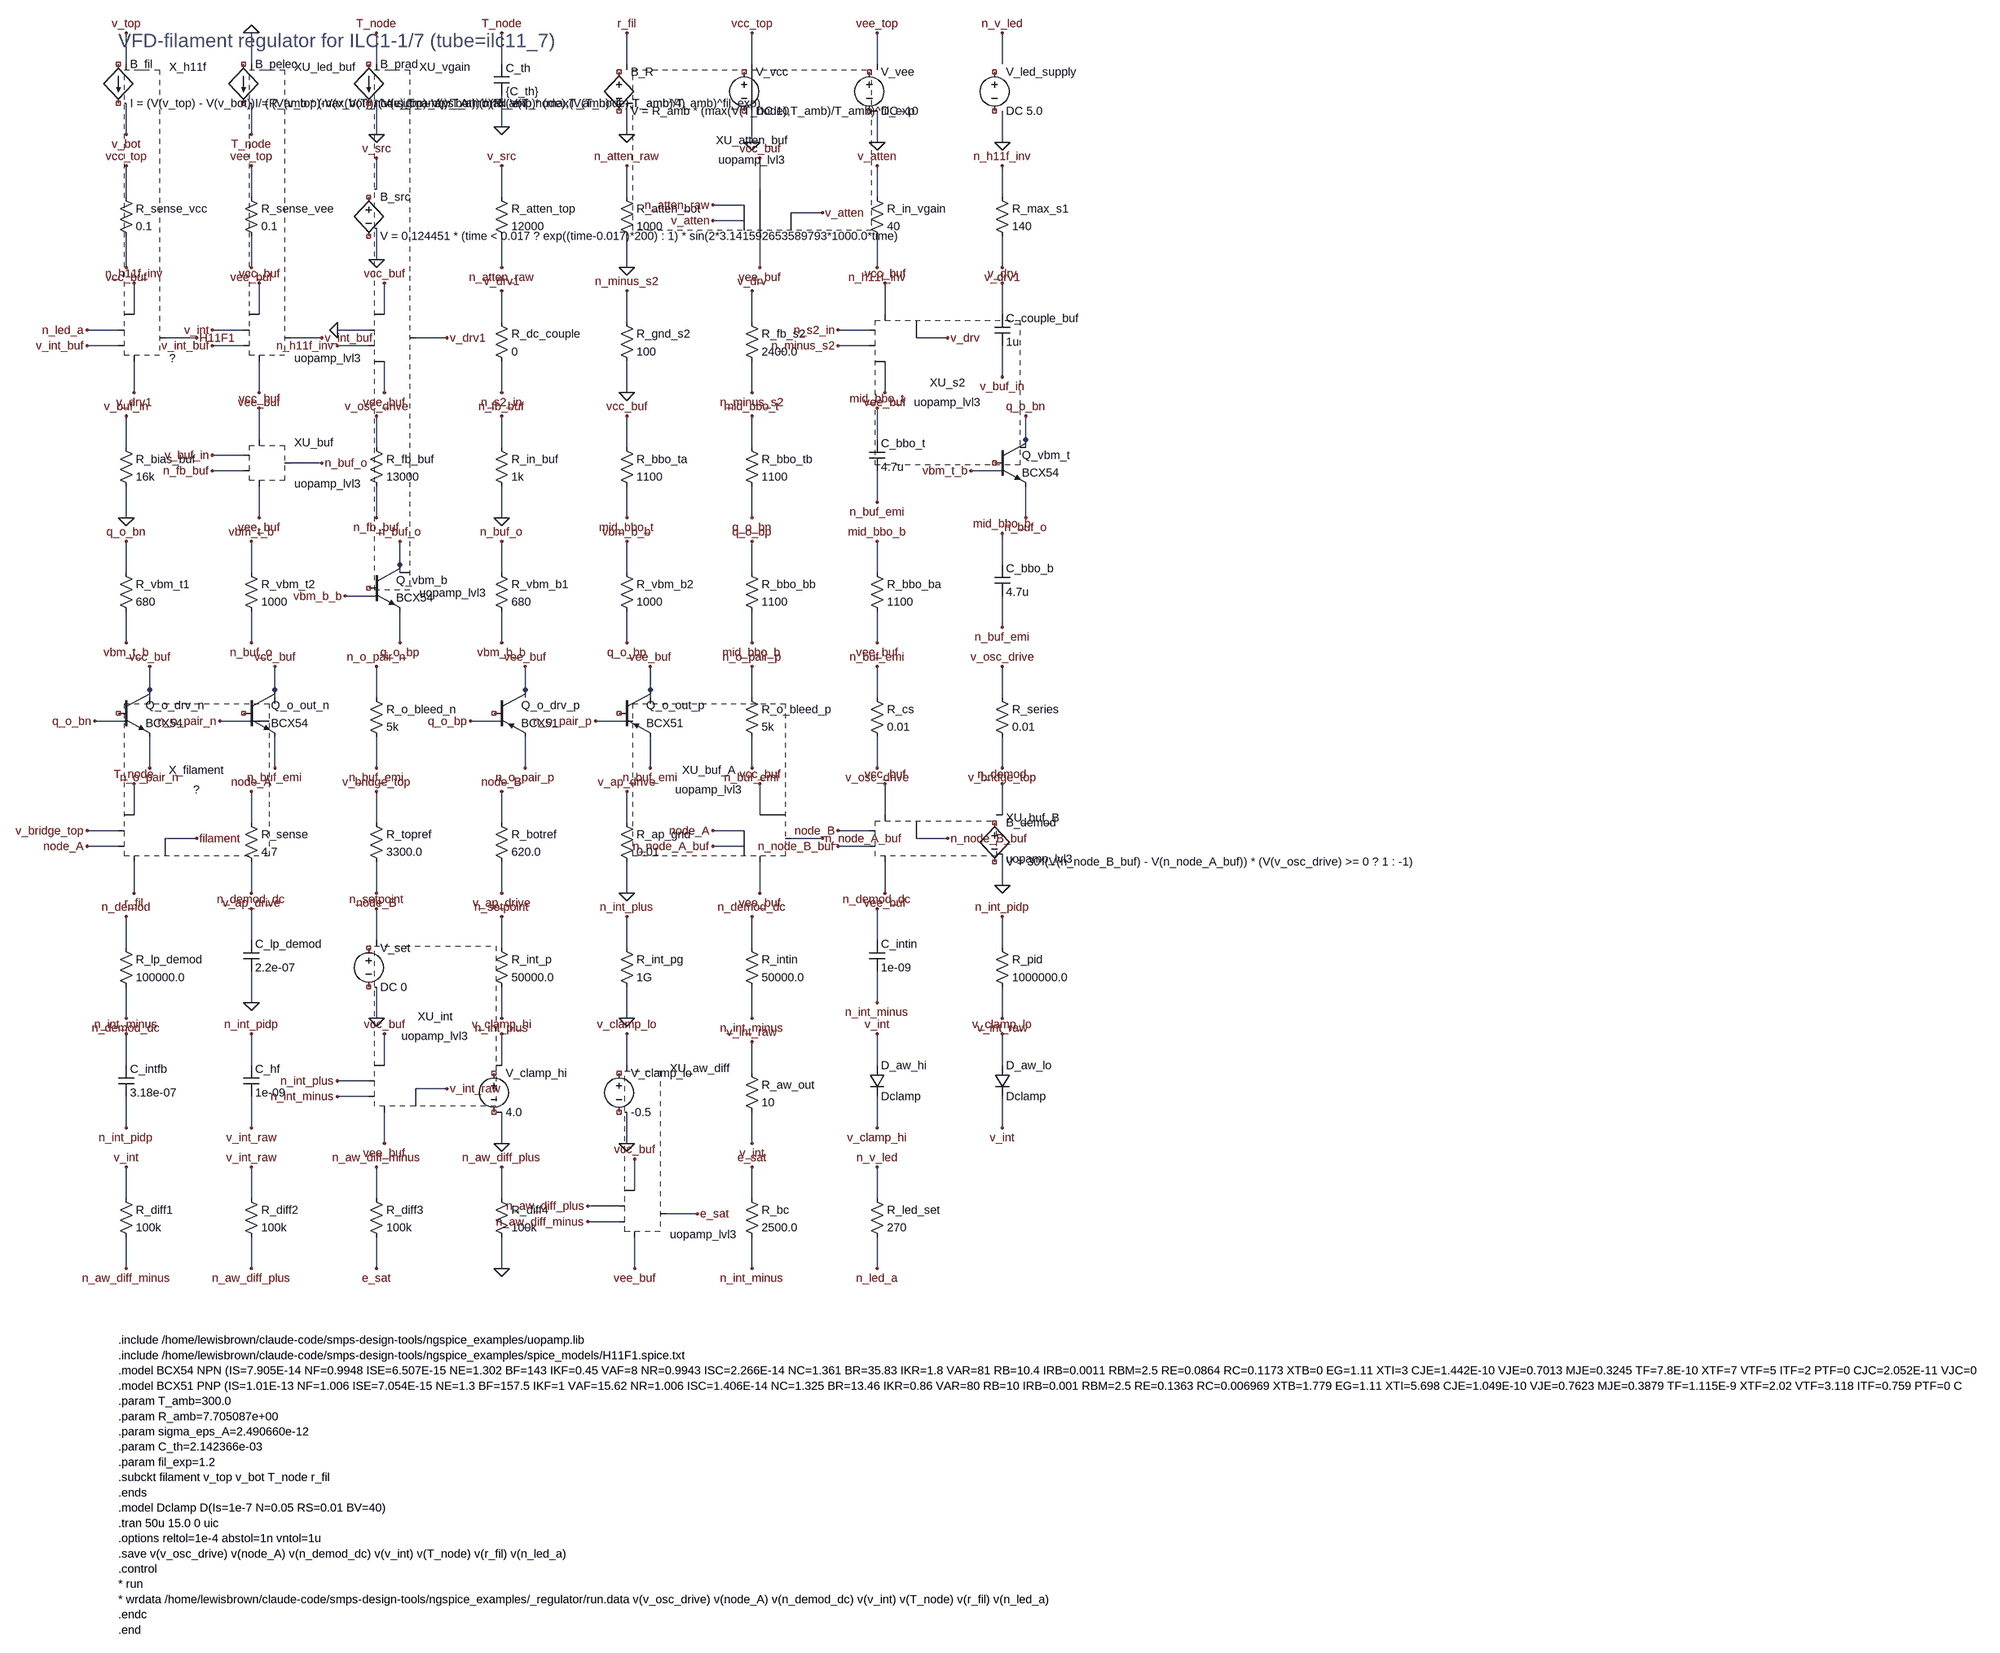
[diagram p0: schematic regulator_ilc11_7.asc]
regulator_ilc11_7.asc, the LTspice schematic file:
Version 4
SHEET 1 8000 8000
TEXT 64 16 Left 4 ;VFD-filament regulator for ILC1-1/7 (tube=ilc11_7)
SYMBOL bi 64 64 R0
SYMATTR InstName B_fil
SYMATTR Value I = (V(v_top) - V(v_bot)) / (R_amb * (max(V(T_node),T_amb)/T_amb)^fil_exp)
WIRE 80 64 80 0
FLAG 80 0 v_top
WIRE 80 144 80 208
FLAG 80 208 v_bot
SYMBOL bi 320 64 R0
SYMATTR InstName B_pelec
SYMATTR Value I = (V(v_top)-V(v_bot))*(V(v_top)-V(v_bot)) / (R_amb * (max(V(T_node),T_amb)/T_amb)^fil_exp)
WIRE 336 64 336 0
FLAG 336 0 0
WIRE 336 144 336 208
FLAG 336 208 T_node
SYMBOL bi 576 64 R0
SYMATTR InstName B_prad
SYMATTR Value I = sigma_eps_A * (max(V(T_node),T_amb)^4 - T_amb^4)
WIRE 592 64 592 0
FLAG 592 0 T_node
WIRE 592 144 592 208
FLAG 592 208 0
SYMBOL cap 832 64 R0
SYMATTR InstName C_th
SYMATTR Value {C_th}
WIRE 848 64 848 0
FLAG 848 0 T_node
WIRE 848 128 848 192
FLAG 848 192 0
SYMBOL bv 1088 64 R0
SYMATTR InstName B_R
SYMATTR Value V = R_amb * (max(V(T_node),T_amb)/T_amb)^fil_exp
WIRE 1104 64 1104 0
FLAG 1104 0 r_fil
WIRE 1104 144 1104 208
FLAG 1104 208 0
SYMBOL voltage 1344 64 R0
SYMATTR InstName V_vcc
SYMATTR Value DC 10
WIRE 1360 64 1360 0
FLAG 1360 0 vcc_top
WIRE 1360 160 1360 224
FLAG 1360 224 0
SYMBOL voltage 1600 64 R0
SYMATTR InstName V_vee
SYMATTR Value DC -10
WIRE 1616 64 1616 0
FLAG 1616 0 vee_top
WIRE 1616 160 1616 224
FLAG 1616 224 0
SYMBOL voltage 1856 64 R0
SYMATTR InstName V_led_supply
SYMATTR Value DC 5.0
WIRE 1872 64 1872 0
FLAG 1872 0 n_v_led
WIRE 1872 160 1872 224
FLAG 1872 224 0
SYMBOL res 64 320 R0
SYMATTR InstName R_sense_vcc
SYMATTR Value 0.1
WIRE 80 336 80 272
FLAG 80 272 vcc_top
WIRE 80 416 80 480
FLAG 80 480 vcc_buf
SYMBOL res 320 320 R0
SYMATTR InstName R_sense_vee
SYMATTR Value 0.1
WIRE 336 336 336 272
FLAG 336 272 vee_top
WIRE 336 416 336 480
FLAG 336 480 vee_buf
SYMBOL bv 576 320 R0
SYMATTR InstName B_src
SYMATTR Value V = 0.124451 * (time < 0.017 ? exp((time-0.017)*200) : 1) * sin(2*3.141592653589793*1000.0*time)
WIRE 592 320 592 256
FLAG 592 256 v_src
WIRE 592 400 592 464
FLAG 592 464 0
SYMBOL res 832 320 R0
SYMATTR InstName R_atten_top
SYMATTR Value 12000
WIRE 848 336 848 272
FLAG 848 272 v_src
WIRE 848 416 848 480
FLAG 848 480 n_atten_raw
SYMBOL res 1088 320 R0
SYMATTR InstName R_atten_bot
SYMATTR Value 1000
WIRE 1104 336 1104 272
FLAG 1104 272 n_atten_raw
WIRE 1104 416 1104 480
FLAG 1104 480 0
SYMBOL opamp2 1344 320 R0
SYMATTR InstName XU_atten_buf
SYMATTR Value uopamp_lvl3
SYMATTR Value2 Avol=5meg GBW=1meg Rin=100g Rout=10 Iq=800u Ilimit=25m Vos=50u Vmax=30 Vrail=0.1
WIRE 1344 352 1280 352
FLAG 1280 352 n_atten_raw
WIRE 1344 384 1280 384
FLAG 1280 384 v_atten
WIRE 1376 320 1376 256
FLAG 1376 256 vcc_buf
WIRE 1376 416 1376 480
FLAG 1376 480 vee_buf
WIRE 1440 368 1504 368
FLAG 1504 368 v_atten
SYMBOL res 1600 320 R0
SYMATTR InstName R_in_vgain
SYMATTR Value 40
WIRE 1616 336 1616 272
FLAG 1616 272 v_atten
WIRE 1616 416 1616 480
FLAG 1616 480 n_h11f_inv
SYMBOL res 1856 320 R0
SYMATTR InstName R_max_s1
SYMATTR Value 140
WIRE 1872 336 1872 272
FLAG 1872 272 n_h11f_inv
WIRE 1872 416 1872 480
FLAG 1872 480 v_drv1
SYMBOL opamp2 64 576 R0
SYMATTR InstName X_h11f
SYMATTR Value ?
WIRE 64 608 0 608
FLAG 0 608 n_led_a
WIRE 64 640 0 640
FLAG 0 640 v_int_buf
WIRE 96 576 96 512
FLAG 96 512 n_h11f_inv
WIRE 96 672 96 736
FLAG 96 736 v_drv1
WIRE 160 624 224 624
FLAG 224 624 H11F1
SYMBOL opamp2 320 576 R0
SYMATTR InstName XU_led_buf
SYMATTR Value uopamp_lvl3
SYMATTR Value2 Avol=5meg GBW=1meg Rin=100g Rout=10 Iq=800u Ilimit=25m Vos=50u Vmax=30 Vrail=0.1
WIRE 320 608 256 608
FLAG 256 608 v_int
WIRE 320 640 256 640
FLAG 256 640 v_int_buf
WIRE 352 576 352 512
FLAG 352 512 vcc_buf
WIRE 352 672 352 736
FLAG 352 736 vee_buf
WIRE 416 624 480 624
FLAG 480 624 v_int_buf
SYMBOL opamp2 576 576 R0
SYMATTR InstName XU_vgain
SYMATTR Value uopamp_lvl3
SYMATTR Value2 Avol=5meg GBW=1meg Rin=100g Rout=10 Iq=800u Ilimit=25m Vos=50u Vmax=30 Vrail=0.1
WIRE 576 608 512 608
FLAG 512 608 0
WIRE 576 640 512 640
FLAG 512 640 n_h11f_inv
WIRE 608 576 608 512
FLAG 608 512 vcc_buf
WIRE 608 672 608 736
FLAG 608 736 vee_buf
WIRE 672 624 736 624
FLAG 736 624 v_drv1
SYMBOL res 832 576 R0
SYMATTR InstName R_dc_couple
SYMATTR Value 0
WIRE 848 592 848 528
FLAG 848 528 v_drv1
WIRE 848 672 848 736
FLAG 848 736 n_s2_in
SYMBOL res 1088 576 R0
SYMATTR InstName R_gnd_s2
SYMATTR Value 100
WIRE 1104 592 1104 528
FLAG 1104 528 n_minus_s2
WIRE 1104 672 1104 736
FLAG 1104 736 0
SYMBOL res 1344 576 R0
SYMATTR InstName R_fb_s2
SYMATTR Value 2400.0
WIRE 1360 592 1360 528
FLAG 1360 528 v_drv
WIRE 1360 672 1360 736
FLAG 1360 736 n_minus_s2
SYMBOL opamp2 1600 576 R0
SYMATTR InstName XU_s2
SYMATTR Value uopamp_lvl3
SYMATTR Value2 Avol=5meg GBW=1meg Rin=100g Rout=10 Iq=800u Ilimit=25m Vos=50u Vmax=30 Vrail=0.1
WIRE 1600 608 1536 608
FLAG 1536 608 n_s2_in
WIRE 1600 640 1536 640
FLAG 1536 640 n_minus_s2
WIRE 1632 576 1632 512
FLAG 1632 512 vcc_buf
WIRE 1632 672 1632 736
FLAG 1632 736 vee_buf
WIRE 1696 624 1760 624
FLAG 1760 624 v_drv
SYMBOL cap 1856 576 R0
SYMATTR InstName C_couple_buf
SYMATTR Value 1u
WIRE 1872 576 1872 512
FLAG 1872 512 v_drv
WIRE 1872 640 1872 704
FLAG 1872 704 v_buf_in
SYMBOL res 64 832 R0
SYMATTR InstName R_bias_buf
SYMATTR Value 16k
WIRE 80 848 80 784
FLAG 80 784 v_buf_in
WIRE 80 928 80 992
FLAG 80 992 0
SYMBOL opamp2 320 832 R0
SYMATTR InstName XU_buf
SYMATTR Value uopamp_lvl3
SYMATTR Value2 Avol=5meg GBW=1meg Rin=100g Rout=10 Iq=800u Ilimit=25m Vos=50u Vmax=30 Vrail=0.1
WIRE 320 864 256 864
FLAG 256 864 v_buf_in
WIRE 320 896 256 896
FLAG 256 896 n_fb_buf
WIRE 352 832 352 768
FLAG 352 768 vcc_buf
WIRE 352 928 352 992
FLAG 352 992 vee_buf
WIRE 416 880 480 880
FLAG 480 880 n_buf_o
SYMBOL res 576 832 R0
SYMATTR InstName R_fb_buf
SYMATTR Value 13000
WIRE 592 848 592 784
FLAG 592 784 v_osc_drive
WIRE 592 928 592 992
FLAG 592 992 n_fb_buf
SYMBOL res 832 832 R0
SYMATTR InstName R_in_buf
SYMATTR Value 1k
WIRE 848 848 848 784
FLAG 848 784 n_fb_buf
WIRE 848 928 848 992
FLAG 848 992 0
SYMBOL res 1088 832 R0
SYMATTR InstName R_bbo_ta
SYMATTR Value 1100
WIRE 1104 848 1104 784
FLAG 1104 784 vcc_buf
WIRE 1104 928 1104 992
FLAG 1104 992 mid_bbo_t
SYMBOL res 1344 832 R0
SYMATTR InstName R_bbo_tb
SYMATTR Value 1100
WIRE 1360 848 1360 784
FLAG 1360 784 mid_bbo_t
WIRE 1360 928 1360 992
FLAG 1360 992 q_o_bn
SYMBOL cap 1600 832 R0
SYMATTR InstName C_bbo_t
SYMATTR Value 4.7u
WIRE 1616 832 1616 768
FLAG 1616 768 mid_bbo_t
WIRE 1616 896 1616 960
FLAG 1616 960 n_buf_emi
SYMBOL npn 1856 832 R0
SYMATTR InstName Q_vbm_t
SYMATTR Value BCX54
WIRE 1920 848 1920 784
FLAG 1920 784 q_o_bn
WIRE 1872 896 1808 896
FLAG 1808 896 vbm_t_b
WIRE 1920 928 1920 992
FLAG 1920 992 n_buf_o
SYMBOL res 64 1088 R0
SYMATTR InstName R_vbm_t1
SYMATTR Value 680
WIRE 80 1104 80 1040
FLAG 80 1040 q_o_bn
WIRE 80 1184 80 1248
FLAG 80 1248 vbm_t_b
SYMBOL res 320 1088 R0
SYMATTR InstName R_vbm_t2
SYMATTR Value 1000
WIRE 336 1104 336 1040
FLAG 336 1040 vbm_t_b
WIRE 336 1184 336 1248
FLAG 336 1248 n_buf_o
SYMBOL npn 576 1088 R0
SYMATTR InstName Q_vbm_b
SYMATTR Value BCX54
WIRE 640 1104 640 1040
FLAG 640 1040 n_buf_o
WIRE 592 1152 528 1152
FLAG 528 1152 vbm_b_b
WIRE 640 1184 640 1248
FLAG 640 1248 q_o_bp
SYMBOL res 832 1088 R0
SYMATTR InstName R_vbm_b1
SYMATTR Value 680
WIRE 848 1104 848 1040
FLAG 848 1040 n_buf_o
WIRE 848 1184 848 1248
FLAG 848 1248 vbm_b_b
SYMBOL res 1088 1088 R0
SYMATTR InstName R_vbm_b2
SYMATTR Value 1000
WIRE 1104 1104 1104 1040
FLAG 1104 1040 vbm_b_b
WIRE 1104 1184 1104 1248
FLAG 1104 1248 q_o_bp
SYMBOL res 1344 1088 R0
SYMATTR InstName R_bbo_bb
SYMATTR Value 1100
WIRE 1360 1104 1360 1040
FLAG 1360 1040 q_o_bp
WIRE 1360 1184 1360 1248
FLAG 1360 1248 mid_bbo_b
SYMBOL res 1600 1088 R0
SYMATTR InstName R_bbo_ba
SYMATTR Value 1100
WIRE 1616 1104 1616 1040
FLAG 1616 1040 mid_bbo_b
WIRE 1616 1184 1616 1248
FLAG 1616 1248 vee_buf
SYMBOL cap 1856 1088 R0
SYMATTR InstName C_bbo_b
SYMATTR Value 4.7u
WIRE 1872 1088 1872 1024
FLAG 1872 1024 mid_bbo_b
WIRE 1872 1152 1872 1216
FLAG 1872 1216 n_buf_emi
SYMBOL npn 64 1344 R0
SYMATTR InstName Q_o_drv_n
SYMATTR Value BCX54
WIRE 128 1360 128 1296
FLAG 128 1296 vcc_buf
WIRE 80 1408 16 1408
FLAG 16 1408 q_o_bn
WIRE 128 1440 128 1504
FLAG 128 1504 n_o_pair_n
SYMBOL npn 320 1344 R0
SYMATTR InstName Q_o_out_n
SYMATTR Value BCX54
WIRE 384 1360 384 1296
FLAG 384 1296 vcc_buf
WIRE 336 1408 272 1408
FLAG 272 1408 n_o_pair_n
WIRE 384 1440 384 1504
FLAG 384 1504 n_buf_emi
SYMBOL res 576 1344 R0
SYMATTR InstName R_o_bleed_n
SYMATTR Value 5k
WIRE 592 1360 592 1296
FLAG 592 1296 n_o_pair_n
WIRE 592 1440 592 1504
FLAG 592 1504 n_buf_emi
SYMBOL pnp 832 1344 R0
SYMATTR InstName Q_o_drv_p
SYMATTR Value BCX51
WIRE 896 1360 896 1296
FLAG 896 1296 vee_buf
WIRE 848 1408 784 1408
FLAG 784 1408 q_o_bp
WIRE 896 1440 896 1504
FLAG 896 1504 n_o_pair_p
SYMBOL pnp 1088 1344 R0
SYMATTR InstName Q_o_out_p
SYMATTR Value BCX51
WIRE 1152 1360 1152 1296
FLAG 1152 1296 vee_buf
WIRE 1104 1408 1040 1408
FLAG 1040 1408 n_o_pair_p
WIRE 1152 1440 1152 1504
FLAG 1152 1504 n_buf_emi
SYMBOL res 1344 1344 R0
SYMATTR InstName R_o_bleed_p
SYMATTR Value 5k
WIRE 1360 1360 1360 1296
FLAG 1360 1296 n_o_pair_p
WIRE 1360 1440 1360 1504
FLAG 1360 1504 n_buf_emi
SYMBOL res 1600 1344 R0
SYMATTR InstName R_cs
SYMATTR Value 0.01
WIRE 1616 1360 1616 1296
FLAG 1616 1296 n_buf_emi
WIRE 1616 1440 1616 1504
FLAG 1616 1504 v_osc_drive
SYMBOL res 1856 1344 R0
SYMATTR InstName R_series
SYMATTR Value 0.01
WIRE 1872 1360 1872 1296
FLAG 1872 1296 v_osc_drive
WIRE 1872 1440 1872 1504
FLAG 1872 1504 v_bridge_top
SYMBOL opamp2 64 1600 R0
SYMATTR InstName X_filament
SYMATTR Value ?
WIRE 64 1632 0 1632
FLAG 0 1632 v_bridge_top
WIRE 64 1664 0 1664
FLAG 0 1664 node_A
WIRE 96 1600 96 1536
FLAG 96 1536 T_node
WIRE 96 1696 96 1760
FLAG 96 1760 r_fil
WIRE 160 1648 224 1648
FLAG 224 1648 filament
SYMBOL res 320 1600 R0
SYMATTR InstName R_sense
SYMATTR Value 4.7
WIRE 336 1616 336 1552
FLAG 336 1552 node_A
WIRE 336 1696 336 1760
FLAG 336 1760 v_ap_drive
SYMBOL res 576 1600 R0
SYMATTR InstName R_topref
SYMATTR Value 3300.0
WIRE 592 1616 592 1552
FLAG 592 1552 v_bridge_top
WIRE 592 1696 592 1760
FLAG 592 1760 node_B
SYMBOL res 832 1600 R0
SYMATTR InstName R_botref
SYMATTR Value 620.0
WIRE 848 1616 848 1552
FLAG 848 1552 node_B
WIRE 848 1696 848 1760
FLAG 848 1760 v_ap_drive
SYMBOL res 1088 1600 R0
SYMATTR InstName R_ap_gnd
SYMATTR Value 0.01
WIRE 1104 1616 1104 1552
FLAG 1104 1552 v_ap_drive
WIRE 1104 1696 1104 1760
FLAG 1104 1760 0
SYMBOL opamp2 1344 1600 R0
SYMATTR InstName XU_buf_A
SYMATTR Value uopamp_lvl3
SYMATTR Value2 Avol=5meg GBW=1meg Rin=100g Rout=10 Iq=800u Ilimit=25m Vos=50u Vmax=30 Vrail=0.1
WIRE 1344 1632 1280 1632
FLAG 1280 1632 node_A
WIRE 1344 1664 1280 1664
FLAG 1280 1664 n_node_A_buf
WIRE 1376 1600 1376 1536
FLAG 1376 1536 vcc_buf
WIRE 1376 1696 1376 1760
FLAG 1376 1760 vee_buf
WIRE 1440 1648 1504 1648
FLAG 1504 1648 n_node_A_buf
SYMBOL opamp2 1600 1600 R0
SYMATTR InstName XU_buf_B
SYMATTR Value uopamp_lvl3
SYMATTR Value2 Avol=5meg GBW=1meg Rin=100g Rout=10 Iq=800u Ilimit=25m Vos=50u Vmax=30 Vrail=0.1
WIRE 1600 1632 1536 1632
FLAG 1536 1632 node_B
WIRE 1600 1664 1536 1664
FLAG 1536 1664 n_node_B_buf
WIRE 1632 1600 1632 1536
FLAG 1632 1536 vcc_buf
WIRE 1632 1696 1632 1760
FLAG 1632 1760 vee_buf
WIRE 1696 1648 1760 1648
FLAG 1760 1648 n_node_B_buf
SYMBOL bv 1856 1600 R0
SYMATTR InstName B_demod
SYMATTR Value V = 30*(V(n_node_B_buf) - V(n_node_A_buf)) * (V(v_osc_drive) >= 0 ? 1 : -1)
WIRE 1872 1600 1872 1536
FLAG 1872 1536 n_demod
WIRE 1872 1680 1872 1744
FLAG 1872 1744 0
SYMBOL res 64 1856 R0
SYMATTR InstName R_lp_demod
SYMATTR Value 100000.0
WIRE 80 1872 80 1808
FLAG 80 1808 n_demod
WIRE 80 1952 80 2016
FLAG 80 2016 n_demod_dc
SYMBOL cap 320 1856 R0
SYMATTR InstName C_lp_demod
SYMATTR Value 2.2e-07
WIRE 336 1856 336 1792
FLAG 336 1792 n_demod_dc
WIRE 336 1920 336 1984
FLAG 336 1984 0
SYMBOL voltage 576 1856 R0
SYMATTR InstName V_set
SYMATTR Value DC 0
WIRE 592 1856 592 1792
FLAG 592 1792 n_setpoint
WIRE 592 1952 592 2016
FLAG 592 2016 0
SYMBOL res 832 1856 R0
SYMATTR InstName R_int_p
SYMATTR Value 50000.0
WIRE 848 1872 848 1808
FLAG 848 1808 n_setpoint
WIRE 848 1952 848 2016
FLAG 848 2016 n_int_plus
SYMBOL res 1088 1856 R0
SYMATTR InstName R_int_pg
SYMATTR Value 1G
WIRE 1104 1872 1104 1808
FLAG 1104 1808 n_int_plus
WIRE 1104 1952 1104 2016
FLAG 1104 2016 0
SYMBOL res 1344 1856 R0
SYMATTR InstName R_intin
SYMATTR Value 50000.0
WIRE 1360 1872 1360 1808
FLAG 1360 1808 n_demod_dc
WIRE 1360 1952 1360 2016
FLAG 1360 2016 n_int_minus
SYMBOL cap 1600 1856 R0
SYMATTR InstName C_intin
SYMATTR Value 1e-09
WIRE 1616 1856 1616 1792
FLAG 1616 1792 n_demod_dc
WIRE 1616 1920 1616 1984
FLAG 1616 1984 n_int_minus
SYMBOL res 1856 1856 R0
SYMATTR InstName R_pid
SYMATTR Value 1000000.0
WIRE 1872 1872 1872 1808
FLAG 1872 1808 n_int_pidp
WIRE 1872 1952 1872 2016
FLAG 1872 2016 v_int_raw
SYMBOL cap 64 2112 R0
SYMATTR InstName C_intfb
SYMATTR Value 3.18e-07
WIRE 80 2112 80 2048
FLAG 80 2048 n_int_minus
WIRE 80 2176 80 2240
FLAG 80 2240 n_int_pidp
SYMBOL cap 320 2112 R0
SYMATTR InstName C_hf
SYMATTR Value 1e-09
WIRE 336 2112 336 2048
FLAG 336 2048 n_int_pidp
WIRE 336 2176 336 2240
FLAG 336 2240 v_int_raw
SYMBOL opamp2 576 2112 R0
SYMATTR InstName XU_int
SYMATTR Value uopamp_lvl3
SYMATTR Value2 Avol=5meg GBW=1meg Rin=100g Rout=10 Iq=800u Ilimit=25m Vos=50u Vmax=30 Vrail=0.1
WIRE 576 2144 512 2144
FLAG 512 2144 n_int_plus
WIRE 576 2176 512 2176
FLAG 512 2176 n_int_minus
WIRE 608 2112 608 2048
FLAG 608 2048 vcc_buf
WIRE 608 2208 608 2272
FLAG 608 2272 vee_buf
WIRE 672 2160 736 2160
FLAG 736 2160 v_int_raw
SYMBOL voltage 832 2112 R0
SYMATTR InstName V_clamp_hi
SYMATTR Value 4.0
WIRE 848 2112 848 2048
FLAG 848 2048 v_clamp_hi
WIRE 848 2208 848 2272
FLAG 848 2272 0
SYMBOL voltage 1088 2112 R0
SYMATTR InstName V_clamp_lo
SYMATTR Value -0.5
WIRE 1104 2112 1104 2048
FLAG 1104 2048 v_clamp_lo
WIRE 1104 2208 1104 2272
FLAG 1104 2272 0
SYMBOL res 1344 2112 R0
SYMATTR InstName R_aw_out
SYMATTR Value 10
WIRE 1360 2128 1360 2064
FLAG 1360 2064 v_int_raw
WIRE 1360 2208 1360 2272
FLAG 1360 2272 v_int
SYMBOL diode 1600 2112 R0
SYMATTR InstName D_aw_hi
SYMATTR Value Dclamp
WIRE 1616 2112 1616 2048
FLAG 1616 2048 v_int
WIRE 1616 2176 1616 2240
FLAG 1616 2240 v_clamp_hi
SYMBOL diode 1856 2112 R0
SYMATTR InstName D_aw_lo
SYMATTR Value Dclamp
WIRE 1872 2112 1872 2048
FLAG 1872 2048 v_clamp_lo
WIRE 1872 2176 1872 2240
FLAG 1872 2240 v_int
SYMBOL res 64 2368 R0
SYMATTR InstName R_diff1
SYMATTR Value 100k
WIRE 80 2384 80 2320
FLAG 80 2320 v_int
WIRE 80 2464 80 2528
FLAG 80 2528 n_aw_diff_minus
SYMBOL res 320 2368 R0
SYMATTR InstName R_diff2
SYMATTR Value 100k
WIRE 336 2384 336 2320
FLAG 336 2320 v_int_raw
WIRE 336 2464 336 2528
FLAG 336 2528 n_aw_diff_plus
SYMBOL res 576 2368 R0
SYMATTR InstName R_diff3
SYMATTR Value 100k
WIRE 592 2384 592 2320
FLAG 592 2320 n_aw_diff_minus
WIRE 592 2464 592 2528
FLAG 592 2528 e_sat
SYMBOL res 832 2368 R0
SYMATTR InstName R_diff4
SYMATTR Value 100k
WIRE 848 2384 848 2320
FLAG 848 2320 n_aw_diff_plus
WIRE 848 2464 848 2528
FLAG 848 2528 0
SYMBOL opamp2 1088 2368 R0
SYMATTR InstName XU_aw_diff
SYMATTR Value uopamp_lvl3
SYMATTR Value2 Avol=5meg GBW=1meg Rin=100g Rout=10 Iq=800u Ilimit=25m Vos=50u Vmax=30 Vrail=0.1
WIRE 1088 2400 1024 2400
FLAG 1024 2400 n_aw_diff_plus
WIRE 1088 2432 1024 2432
FLAG 1024 2432 n_aw_diff_minus
WIRE 1120 2368 1120 2304
FLAG 1120 2304 vcc_buf
WIRE 1120 2464 1120 2528
FLAG 1120 2528 vee_buf
WIRE 1184 2416 1248 2416
FLAG 1248 2416 e_sat
SYMBOL res 1344 2368 R0
SYMATTR InstName R_bc
SYMATTR Value 2500.0
WIRE 1360 2384 1360 2320
FLAG 1360 2320 e_sat
WIRE 1360 2464 1360 2528
FLAG 1360 2528 n_int_minus
SYMBOL res 1600 2368 R0
SYMATTR InstName R_led_set
SYMATTR Value 270
WIRE 1616 2384 1616 2320
FLAG 1616 2320 n_v_led
WIRE 1616 2464 1616 2528
FLAG 1616 2528 n_led_a
TEXT 64 2816 Left 2 !.include /home/lewisbrown/claude-code/smps-design-tools/ngspice_examples/uopamp.lib\n.include /home/lewisbrown/claude-code/smps-design-tools/ngspice_examples/spice_models/H11F1.spice.txt\n.model BCX54 NPN (IS=7.905E-14 NF=0.9948 ISE=6.507E-15 NE=1.302 BF=143 IKF=0.45 VAF=8 NR=0.9943 ISC=2.266E-14 NC=1.361 BR=35.83 IKR=1.8 VAR=81 RB=10.4 IRB=0.0011 RBM=2.5 RE=0.0864 RC=0.1173 XTB=0 EG=1.11 XTI=3 CJE=1.442E-10 VJE=0.7013 MJE=0.3245 TF=7.8E-10 XTF=7 VTF=5 ITF=2 PTF=0 CJC=2.052E-11 VJC=0.5 MJC=0.4015 XCJC=1 TR=2.3E-8 CJS=0 VJS=0.75 MJS=0.333 FC=0.9)\n.model BCX51 PNP (IS=1.01E-13 NF=1.006 ISE=7.054E-15 NE=1.3 BF=157.5 IKF=1 VAF=15.62 NR=1.006 ISC=1.406E-14 NC=1.325 BR=13.46 IKR=0.86 VAR=80 RB=10 IRB=0.001 RBM=2.5 RE=0.1363 RC=0.006969 XTB=1.779 EG=1.11 XTI=5.698 CJE=1.049E-10 VJE=0.7623 MJE=0.3879 TF=1.115E-9 XTF=2.02 VTF=3.118 ITF=0.759 PTF=0 CJC=4.998E-11 VJC=0.9968 MJC=0.4942 XCJC=1 TR=6.5E-8 CJS=0 VJS=0.75 MJS=0.333 FC=0.8944)\n.param T_amb=300.0\n.param R_amb=7.705087e+00\n.param sigma_eps_A=2.490660e-12\n.param C_th=2.142366e-03\n.param fil_exp=1.2\n.subckt filament v_top v_bot T_node r_fil\n.ends\n.model Dclamp D(Is=1e-7 N=0.05 RS=0.01 BV=40)\n.tran 50u 15.0 0 uic\n.options reltol=1e-4 abstol=1n vntol=1u\n.save v(v_osc_drive) v(node_A) v(n_demod_dc) v(v_int) v(T_node) v(r_fil) v(n_led_a)\n.control\n* run\n* wrdata /home/lewisbrown/claude-code/smps-design-tools/ngspice_examples/_regulator/run.data v(v_osc_drive) v(node_A) v(n_demod_dc) v(v_int) v(T_node) v(r_fil) v(n_led_a)\n.endc\n.end

The netlist it stands for:
* regulator_ilc11_7.asc
B_fil NC_01 NC_02 I = (V(v_top) - V(v_bot)) / (R_amb * (max(V(T_node),T_amb)/T_amb)^fil_exp)
B_pelec NC_03 NC_04 I = (V(v_top)-V(v_bot))*(V(v_top)-V(v_bot)) / (R_amb * (max(V(T_node),T_amb)/T_amb)^fil_exp)
B_prad NC_05 NC_06 I = sigma_eps_A * (max(V(T_node),T_amb)^4 - T_amb^4)
C_th T_node 0 {C_th}
B_R NC_07 NC_08 V = R_amb * (max(V(T_node),T_amb)/T_amb)^fil_exp
V_vcc NC_09 NC_10 DC 10
V_vee NC_11 NC_12 DC -10
V_led_supply NC_13 NC_14 DC 5.0
R_sense_vcc vcc_top vcc_buf 0.1
R_sense_vee vee_top vee_buf 0.1
B_src NC_15 NC_16 V = 0.124451 * (time < 0.017 ? exp((time-0.017)*200) : 1) * sin(2*3.141592653589793*1000.0*time)
R_atten_top v_src n_atten_raw 12000
R_atten_bot n_atten_raw 0 1000
* XU_atten_buf: uopamp_lvl3 Avol=5meg GBW=1meg Rin=100g Rout=10 Iq=800u Ilimit=25m Vos=50u Vmax=30 Vrail=0.1 (symbol opamp2 not available, pin order unknown); nets seen at it: 0, n_atten_raw, r_fil, v_atten, vcc_buf, vcc_top, vee_buf, vee_top
R_in_vgain v_atten n_h11f_inv 40
R_max_s1 n_h11f_inv v_drv1 140
* X_h11f: ? (symbol opamp2 not available, pin order unknown); nets seen at it: H11F1, n_h11f_inv, n_led_a, v_bot, v_drv1, v_int_buf, v_top
* XU_led_buf: uopamp_lvl3 Avol=5meg GBW=1meg Rin=100g Rout=10 Iq=800u Ilimit=25m Vos=50u Vmax=30 Vrail=0.1 (symbol opamp2 not available, pin order unknown); nets seen at it: 0, T_node, v_int, v_int_buf, vcc_buf, vee_buf
* XU_vgain: uopamp_lvl3 Avol=5meg GBW=1meg Rin=100g Rout=10 Iq=800u Ilimit=25m Vos=50u Vmax=30 Vrail=0.1 (symbol opamp2 not available, pin order unknown); nets seen at it: 0, n_buf_o, n_h11f_inv, T_node, v_drv1, v_src, vbm_b_b, vcc_buf, vee_buf
R_dc_couple v_drv1 n_s2_in 0
R_gnd_s2 n_minus_s2 0 100
R_fb_s2 v_drv n_minus_s2 2400.0
* XU_s2: uopamp_lvl3 Avol=5meg GBW=1meg Rin=100g Rout=10 Iq=800u Ilimit=25m Vos=50u Vmax=30 Vrail=0.1 (symbol opamp2 not available, pin order unknown); nets seen at it: n_minus_s2, n_s2_in, q_o_bn, v_drv, vbm_t_b, vcc_buf, vee_buf
C_couple_buf v_drv v_buf_in 1u
R_bias_buf v_buf_in 0 16k
* XU_buf: uopamp_lvl3 Avol=5meg GBW=1meg Rin=100g Rout=10 Iq=800u Ilimit=25m Vos=50u Vmax=30 Vrail=0.1 (symbol opamp2 not available, pin order unknown); nets seen at it: n_buf_o, n_fb_buf, v_buf_in, vcc_buf, vee_buf
R_fb_buf v_osc_drive n_fb_buf 13000
R_in_buf n_fb_buf 0 1k
R_bbo_ta vcc_buf mid_bbo_t 1100
R_bbo_tb mid_bbo_t q_o_bn 1100
C_bbo_t mid_bbo_t n_buf_emi 4.7u
Q_vbm_t q_o_bn NC_17 n_buf_o 0 BCX54
R_vbm_t1 q_o_bn vbm_t_b 680
R_vbm_t2 vbm_t_b n_buf_o 1000
Q_vbm_b n_buf_o NC_18 q_o_bp 0 BCX54
R_vbm_b1 n_buf_o vbm_b_b 680
R_vbm_b2 vbm_b_b q_o_bp 1000
R_bbo_bb q_o_bp mid_bbo_b 1100
R_bbo_ba mid_bbo_b vee_buf 1100
C_bbo_b mid_bbo_b n_buf_emi 4.7u
Q_o_drv_n vcc_buf NC_19 n_o_pair_n 0 BCX54
Q_o_out_n vcc_buf NC_20 n_buf_emi 0 BCX54
R_o_bleed_n n_o_pair_n n_buf_emi 5k
* Q_o_drv_p: BCX51 (symbol pnp not certain, pin order unknown); nets seen at it: 0, n_o_pair_p, vee_buf
Q_o_out_p vee_buf NC_22 n_buf_emi 0 BCX51
R_o_bleed_p n_o_pair_p n_buf_emi 5k
R_cs n_buf_emi v_osc_drive 0.01
R_series v_osc_drive v_bridge_top 0.01
* X_filament: ? (symbol opamp2 not available, pin order unknown); nets seen at it: filament, n_o_pair_n, node_A, q_o_bn, r_fil, T_node, v_bridge_top, vcc_buf
R_sense node_A v_ap_drive 4.7
R_topref v_bridge_top node_B 3300.0
R_botref node_B v_ap_drive 620.0
R_ap_gnd v_ap_drive 0 0.01
* XU_buf_A: uopamp_lvl3 Avol=5meg GBW=1meg Rin=100g Rout=10 Iq=800u Ilimit=25m Vos=50u Vmax=30 Vrail=0.1 (symbol opamp2 not available, pin order unknown); nets seen at it: n_node_A_buf, n_o_pair_p, node_A, vcc_buf, vee_buf
* XU_buf_B: uopamp_lvl3 Avol=5meg GBW=1meg Rin=100g Rout=10 Iq=800u Ilimit=25m Vos=50u Vmax=30 Vrail=0.1 (symbol opamp2 not available, pin order unknown); nets seen at it: 0, n_demod, n_node_B_buf, node_B, vcc_buf, vee_buf
B_demod NC_23 NC_24 V = 30*(V(n_node_B_buf) - V(n_node_A_buf)) * (V(v_osc_drive) >= 0 ? 1 : -1)
R_lp_demod n_demod n_demod_dc 100000.0
C_lp_demod n_demod_dc 0 2.2e-07
V_set NC_25 NC_26 DC 0
R_int_p n_setpoint n_int_plus 50000.0
R_int_pg n_int_plus 0 1G
R_intin n_demod_dc n_int_minus 50000.0
C_intin n_demod_dc n_int_minus 1e-09
R_pid n_int_pidp v_int_raw 1000000.0
C_intfb n_int_minus n_int_pidp 3.18e-07
C_hf n_int_pidp v_int_raw 1e-09
* XU_int: uopamp_lvl3 Avol=5meg GBW=1meg Rin=100g Rout=10 Iq=800u Ilimit=25m Vos=50u Vmax=30 Vrail=0.1 (symbol opamp2 not available, pin order unknown); nets seen at it: 0, n_int_minus, n_int_plus, n_setpoint, v_clamp_hi, v_int_raw, vcc_buf, vee_buf
V_clamp_hi NC_27 NC_28 4.0
V_clamp_lo NC_29 NC_30 -0.5
R_aw_out v_int_raw v_int 10
D_aw_hi v_int v_clamp_hi Dclamp
D_aw_lo v_clamp_lo v_int Dclamp
R_diff1 v_int n_aw_diff_minus 100k
R_diff2 v_int_raw n_aw_diff_plus 100k
R_diff3 n_aw_diff_minus e_sat 100k
R_diff4 n_aw_diff_plus 0 100k
* XU_aw_diff: uopamp_lvl3 Avol=5meg GBW=1meg Rin=100g Rout=10 Iq=800u Ilimit=25m Vos=50u Vmax=30 Vrail=0.1 (symbol opamp2 not available, pin order unknown); nets seen at it: 0, e_sat, n_aw_diff_minus, n_aw_diff_plus, v_clamp_lo, vcc_buf, vee_buf
R_bc e_sat n_int_minus 2500.0
R_led_set n_v_led n_led_a 270
.model D D
.lib standard.dio
.model NPN NPN
.model PNP PNP
.lib standard.bjt
* VFD-filament regulator for ILC1-1/7 (tube=ilc11_7)
.include /home/lewisbrown/claude-code/smps-design-tools/ngspice_examples/uopamp.lib
.include /home/lewisbrown/claude-code/smps-design-tools/ngspice_examples/spice_models/H11F1.spice.txt
.model BCX54 NPN (IS=7.905E-14 NF=0.9948 ISE=6.507E-15 NE=1.302 BF=143 IKF=0.45 VAF=8 NR=0.9943 ISC=2.266E-14 NC=1.361 BR=35.83 IKR=1.8 VAR=81 RB=10.4 IRB=0.0011 RBM=2.5 RE=0.0864 RC=0.1173 XTB=0 EG=1.11 XTI=3 CJE=1.442E-10 VJE=0.7013 MJE=0.3245 TF=7.8E-10 XTF=7 VTF=5 ITF=2 PTF=0 CJC=2.052E-11 VJC=0.5 MJC=0.4015 XCJC=1 TR=2.3E-8 CJS=0 VJS=0.75 MJS=0.333 FC=0.9)
.model BCX51 PNP (IS=1.01E-13 NF=1.006 ISE=7.054E-15 NE=1.3 BF=157.5 IKF=1 VAF=15.62 NR=1.006 ISC=1.406E-14 NC=1.325 BR=13.46 IKR=0.86 VAR=80 RB=10 IRB=0.001 RBM=2.5 RE=0.1363 RC=0.006969 XTB=1.779 EG=1.11 XTI=5.698 CJE=1.049E-10 VJE=0.7623 MJE=0.3879 TF=1.115E-9 XTF=2.02 VTF=3.118 ITF=0.759 PTF=0 CJC=4.998E-11 VJC=0.9968 MJC=0.4942 XCJC=1 TR=6.5E-8 CJS=0 VJS=0.75 MJS=0.333 FC=0.8944)
.param T_amb=300.0
.param R_amb=7.705087e+00
.param sigma_eps_A=2.490660e-12
.param C_th=2.142366e-03
.param fil_exp=1.2
.subckt filament v_top v_bot T_node r_fil
.ends
.model Dclamp D(Is=1e-7 N=0.05 RS=0.01 BV=40)
.tran 50u 15.0 0 uic
.options reltol=1e-4 abstol=1n vntol=1u
.save v(v_osc_drive) v(node_A) v(n_demod_dc) v(v_int) v(T_node) v(r_fil) v(n_led_a)
.control
* run
* wrdata /home/lewisbrown/claude-code/smps-design-tools/ngspice_examples/_regulator/run.data v(v_osc_drive) v(node_A) v(n_demod_dc) v(v_int) v(T_node) v(r_fil) v(n_led_a)
.endc
.end
.backanno
.end